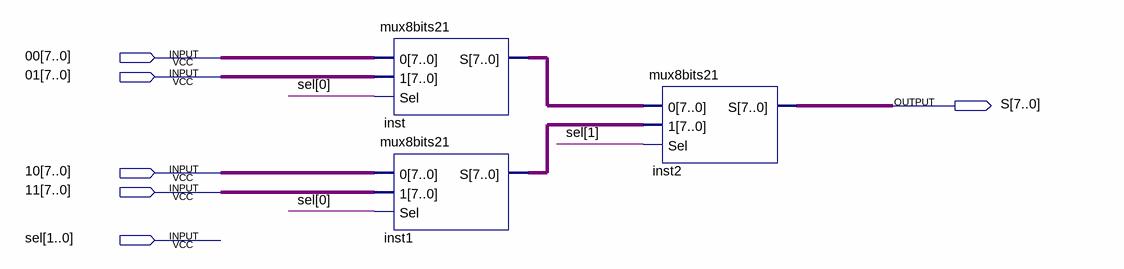
[diagram p0: schematic sheet]
// Quartus schematic mux41.bdf as structural Verilog: 3 symbols, 6 pins
module mux41 (
  input  [7:0] \00 ,
  input  [7:0] \01 ,
  input  [7:0] \10 ,
  input  [7:0] \11 ,
  input  [1:0] sel,
  output [7:0] S
);

  wire [7:0] inst1_s, inst_s;

  mux8bits21 inst (.\0 (\00 ), .\1 (\01 ), .Sel(sel[0]), .S(inst_s));
  mux8bits21 inst1 (.\0 (\10 ), .\1 (\11 ), .Sel(sel[0]), .S(inst1_s));
  mux8bits21 inst2 (.\0 (inst_s), .\1 (inst1_s), .Sel(sel[1]), .S(S));
endmodule
